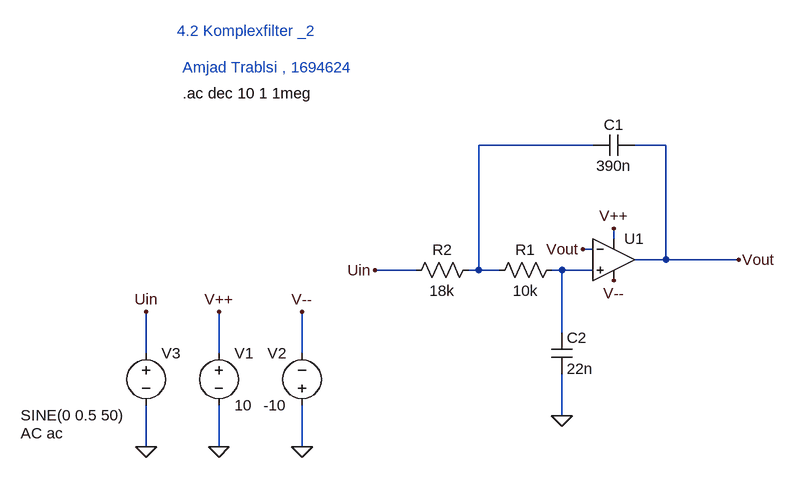
[diagram p0: schematic Komplex_Filter_2.asc]
Komplex_Filter_2.asc, the LTspice schematic file:
Version 4
SHEET 1 1020 680
WIRE 464 -16 288 -16
WIRE 576 -16 528 -16
WIRE 496 128 496 112
WIRE 464 144 448 144
WIRE 576 160 576 -16
WIRE 576 160 528 160
WIRE 688 160 576 160
WIRE 192 176 128 176
WIRE 288 176 288 -16
WIRE 288 176 272 176
WIRE 320 176 288 176
WIRE 416 176 400 176
WIRE 464 176 416 176
WIRE 416 272 416 176
WIRE -224 304 -224 240
WIRE -112 304 -112 240
WIRE 16 304 16 240
WIRE 416 400 416 336
WIRE -224 448 -224 384
WIRE -112 448 -112 384
WIRE 16 448 16 384
FLAG 416 400 0
FLAG -112 448 0
FLAG -112 240 V++
FLAG 496 112 V++
FLAG 16 448 0
FLAG 16 240 V--
FLAG 496 192 V--
FLAG 688 160 Vout
FLAG -224 448 0
FLAG -224 240 Uin
FLAG 128 176 Uin
FLAG 448 144 Vout
SYMBOL voltage -112 288 R0
WINDOW 123 0 0 Left 0
WINDOW 39 0 0 Left 0
SYMATTR InstName V1
SYMATTR Value 10
SYMBOL voltage 16 400 R180
WINDOW 0 24 96 Left 2
WINDOW 3 24 16 Left 2
WINDOW 123 0 0 Left 0
WINDOW 39 0 0 Left 0
SYMATTR InstName V2
SYMATTR Value -10
SYMBOL voltage -224 288 R0
WINDOW 3 -193 111 Left 2
WINDOW 123 -193 139 Left 2
WINDOW 39 0 0 Left 0
SYMATTR Value SINE(0 0.5 50)
SYMATTR Value2 AC ac
SYMATTR InstName V3
SYMBOL cap 528 -32 R90
WINDOW 0 0 32 VBottom 2
WINDOW 3 32 32 VTop 2
SYMATTR InstName C1
SYMATTR Value 390n
SYMBOL res 416 160 R90
WINDOW 0 0 56 VBottom 2
WINDOW 3 32 56 VTop 2
SYMATTR InstName R1
SYMATTR Value 10k
SYMBOL res 288 160 R90
WINDOW 0 0 56 VBottom 2
WINDOW 3 32 56 VTop 2
SYMATTR InstName R2
SYMATTR Value 18k
SYMBOL cap 400 272 R0
SYMATTR InstName C2
SYMATTR Value 22n
SYMBOL OpAmps/UniversalOpAmp 496 160 R0
SYMATTR InstName U1
TEXT -176 -192 Left 2 ;4.2 Komplexfilter _2
TEXT -168 -96 Left 2 !.ac dec 10 1 1meg
TEXT -168 -136 Left 2 ;Amjad Trablsi , 1694624

The netlist it stands for:
* Komplex_Filter_2.asc
V1 V++ 0 10
V2 0 V-- -10
V3 Uin 0 SINE(0 0.5 50) AC ac
C1 Vout N001 390n
R1 N002 N001 10k
R2 N001 Uin 18k
C2 N002 0 22n
XU1 N002 Vout V++ V-- Vout level1 Avol=1Meg GBW=10Meg Vos=0 En=0 Enk=0 In=0 Ink=0 Rin=500Meg  ; pins In+ In- V+ V- OUT
* 4.2 Komplexfilter _2
.ac dec 10 1 1meg
* Amjad Trablsi , 1694624
.lib UniversalOpAmp1.lib
.backanno
.end